# EAGLE schematic System critical signals PCB (EAGLE 9.6.2)
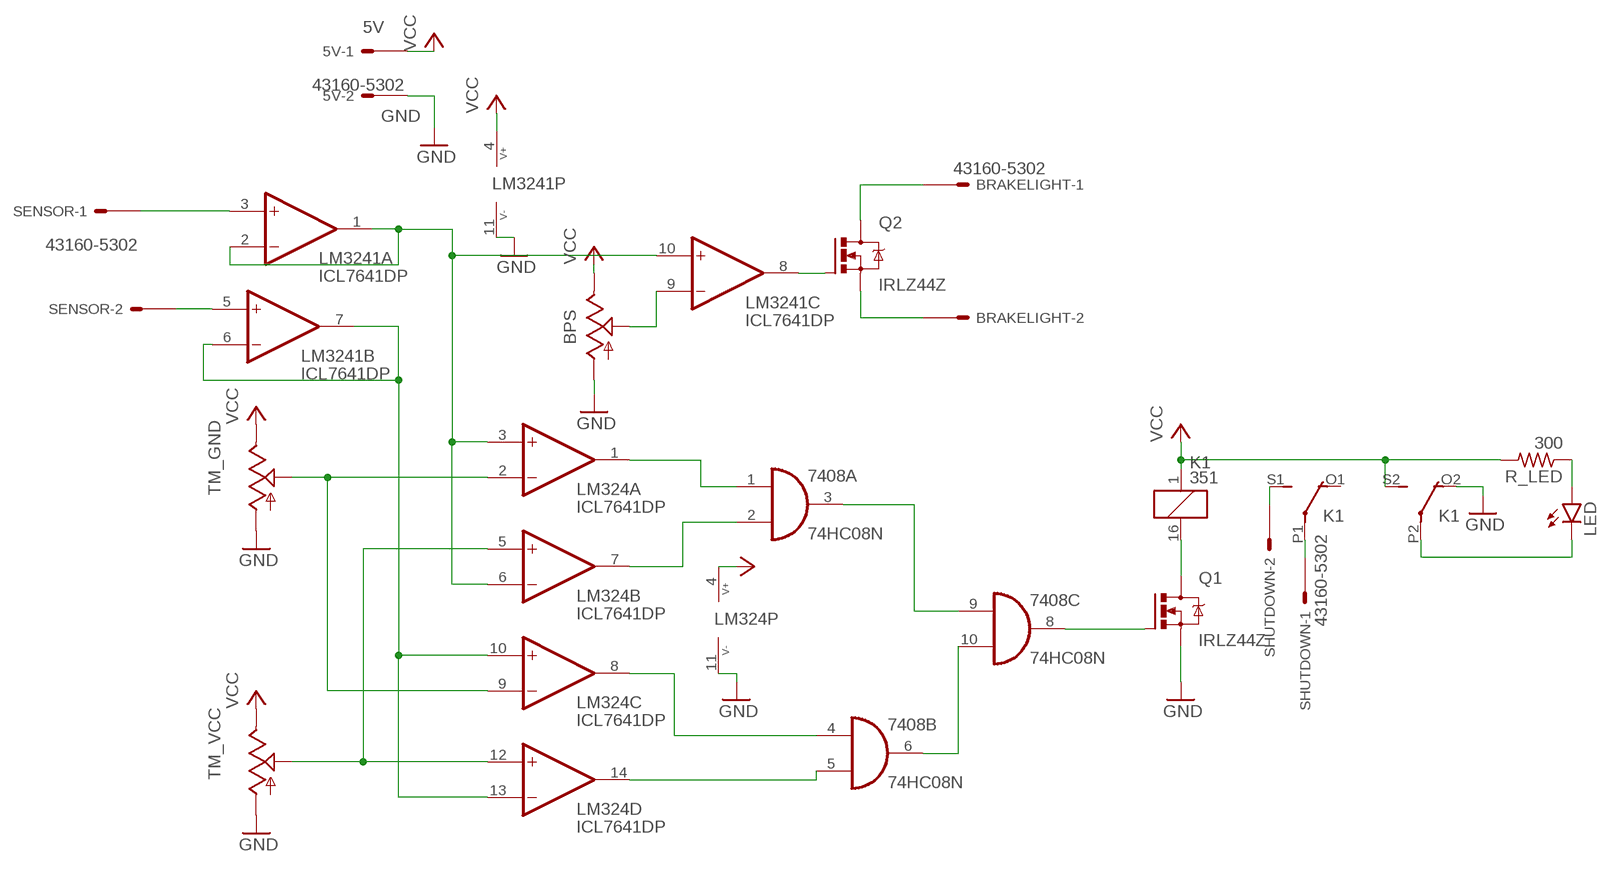
[diagram p0: schematic, sheet 1]

## Parts
5V  43160-5302  [43160-XX02]
7408  74HC08N  [DIL14]
BPS  TRIM  [6MM]
BRAKELIGHT  43160-5302  [43160-XX02]
K1  351  [351]
LED  LEDCHIP-LED0805  [CHIP-LED0805]
LM324  ICL7641DP  [DIL14]
LM3241  ICL7641DP  [DIL14]
Q1  IRLZ44Z  [TO220BH]
Q2  IRLZ44Z  [TO220BH]
R_LED  300  R-US_M0805  [M0805]
SENSOR  43160-5302  [43160-XX02]
SHUTDOWN  43160-5302  [43160-XX02]
TM_GND  TRIM  [6MM]
TM_VCC  TRIM  [6MM]

## Nets
BPS: LM3241.3(A:+IN) SENSOR.1@1(-1:S)
GND: 5V.2@1(-2:S) BPS.A K1.O2(3:O) LM324.11(P:V-) LM3241.11(P:V-) Q1.S TM_GND.A TM_VCC.A
N$1: 7408.4(B:I0) LM324.8(C:OUT)
N$2: LM324.3(A:+IN) LM324.6(B:-IN) LM3241.1(A:OUT) LM3241.2(A:-IN) LM3241.10(C:+IN)
N$3: LM324.10(C:+IN) LM324.13(D:-IN) LM3241.6(B:-IN) LM3241.7(B:OUT)
N$4: 7408.5(B:I1) LM324.14(D:OUT)
N$5: 7408.1(A:I0) LM324.1(A:OUT)
N$6: 7408.2(A:I1) LM324.7(B:OUT)
N$7: 7408.3(A:O) 7408.9(C:I0)
N$8: 7408.6(B:O) 7408.10(C:I1)
N$9: 7408.8(C:O) Q1.G
N$10: K1.16 Q1.D
N$11: K1.S1(2:S) SHUTDOWN.2@1(-2:S)
N$12: K1.P1(2:P) SHUTDOWN.1@1(-1:S)
N$13: LED.A R_LED.1
N$14: BPS.S LM3241.9(C:-IN)
N$15: LM3241.8(C:OUT) Q2.G
N$16: BRAKELIGHT.1@1(-1:S) Q2.D
N$17: BRAKELIGHT.2@1(-2:S) Q2.S
N$18: K1.P2(3:P) LED.C
N$23: LM324.2(A:-IN) LM324.9(C:-IN) TM_GND.S
N$25: LM324.5(B:+IN) LM324.12(D:+IN) TM_VCC.S
TPS: LM3241.5(B:+IN) SENSOR.2@1(-2:S)
VCC: 5V.1@1(-1:S) BPS.E K1.1 K1.S2(3:S) LM324.4(P:V+) LM3241.4(P:V+) R_LED.2 TM_GND.E TM_VCC.E
Unconnected: 5V.1@2(-1:S) 5V.2@2(-2:S) 7408.11(D:O) 7408.12(D:I0) 7408.13(D:I1) BRAKELIGHT.1@2(-1:S) BRAKELIGHT.2@2(-2:S) K1.O1(2:O) LM3241.12(D:+IN) LM3241.13(D:-IN) LM3241.14(D:OUT) SENSOR.1@2(-1:S) SENSOR.2@2(-2:S) SHUTDOWN.1@2(-1:S) SHUTDOWN.2@2(-2:S)

## Notes on the sheet
- 5V
- GND

## Power pins joined to a net without a drawn wire
GND: 7408.7(P:GND)
VCC: 7408.14(P:VCC)

## Library data of the parts
5V BRAKELIGHT SENSOR SHUTDOWN = con-molex:43160-*02: SDA-43160 Connector Source: http://www.molex.com/pdm_docs/sd/431601306_sd.pdf; MF: MOLEX; MPN: 43160-5302; OC_FARNELL: unknown; OC_NEWARK: 92M1498
7408 = 74xx-eu:74*08: Quad 2-input AND gate
BPS TM_GND TM_VCC = adafruit:TRIM
K1 = relay:351: RELAY 2 x switch, Omron; OC_FARNELL: unknown; OC_NEWARK: unknown
LED = led:LED: LED OSRAM: - CHIPLED LG R971, LG N971, LY N971, LG Q971, LY Q971, LO R971, LY R971 LH N974, LH R974 LS Q976, LO Q976, LY Q976 LO Q996 - Hyper CHIPLED LW Q18S LB Q993, LB Q99A, LB R99A - SideLED LS A670, LO A670, LY A670, LG A670, LP A670 LB A673, LV A673, LT A673, LW A673 LH A674 LY A675 LS A676, LA A676, LO A676, LY A676, LW A676 LS A679, LY A679, LG A679 - Hyper Micro SIDELED® LS Y876, LA Y876, LO Y876, LY Y876 LT Y87S - SmartLED LW L88C, LW L88S LB L89C, LB L89S, LG L890 LS L89K, LO L89K, LY L89K LS L896, LA L896, LO L896, LY L896 - TOPLED LS T670, LO T670, LY T670, LG T670, LP T670 LSG T670, LSP T670, LSY T670, LOP T670, LYG T670 LG T671, LOG T671, LSG T671 LB T673, LV T673, LT T673, LW T673 LH T674 LS T676, LA T676, LO T676, LY T676, LB T676, LH T676, LSB T676, LW T676 LB T67C, LV T67C, LT T67C, LS T67K, LO T67K, LY T67K, LW E67C LS E67B, LA E67B, LO E67B, LY E67B, LB E67C, LV E67C, LT E67C LW T67C LS T679, LY T679, LG T679 LS T770, LO T770, LY T770, LG T770, LP T770 LB T773, LV T773, LT T773, LW T773 LH T774 LS E675, LA E675, LY E675, LS T675 LS T776, LA T776, LO T776, LY T776, LB T776 LHGB T686 LT T68C, LB T68C - Hyper Mini TOPLED® LB M676 - Mini TOPLED Santana® LG M470 LS M47K, LO M47K, LY M47K Source: http://www.osram.convergy.de LUXEON: - LUMILED® LXK2-PW12-R00, LXK2-PW12-S00, LXK2-PW14-U00, LXK2-PW14-V00 LXK2-PM12-R00, LXK2-PM12-S00, LXK2-PM14-U00 LXK2-PE12-Q00, LXK2-PE12-R00, LXK2-PE12-S00, LXK2-PE14-T00, LXK2-PE14-U00 LXK2-PB12-K00, LXK2-PB12-L00, LXK2-PB12-M00, LXK2-PB14-N00, LXK2-PB14-P00, LXK2-PB14-Q00 LXK2-PR12-L00, LXK2-PR12-M00, LXK2-PR14-Q00, LXK2-PR14-R00 LXK2-PD12-Q00, LXK2-PD12-R00, LXK2-PD12-S00 LXK2-PH12-R00, LXK2-PH12-S00 LXK2-PL12-P00, LXK2-PL12-Q00, LXK2-PL12-R00 Source: www.luxeon.com KINGBRIGHT: KA-3528ASYC Source: www.kingbright.com
LM324 LM3241 = maxim:ICL764*: Quad Operational Amplifiers Source: http://datasheets.maxim-ic.com/en/ds/ICL7612-ICL764X.pdf; OC_FARNELL: unknown; OC_NEWARK: unknown
Q1 Q2 = transistor-power:IRLZ44Z: N-Channel HEXFET® Power MOSFET Logic Level AUTOMOTIVE MOSFET Source: http://www.irf.com/product-info/datasheets/data/irlz44zpbf.pdf
R_LED = rcl:R-US_: RESISTOR, American symbol; SPICEPREFIX: R